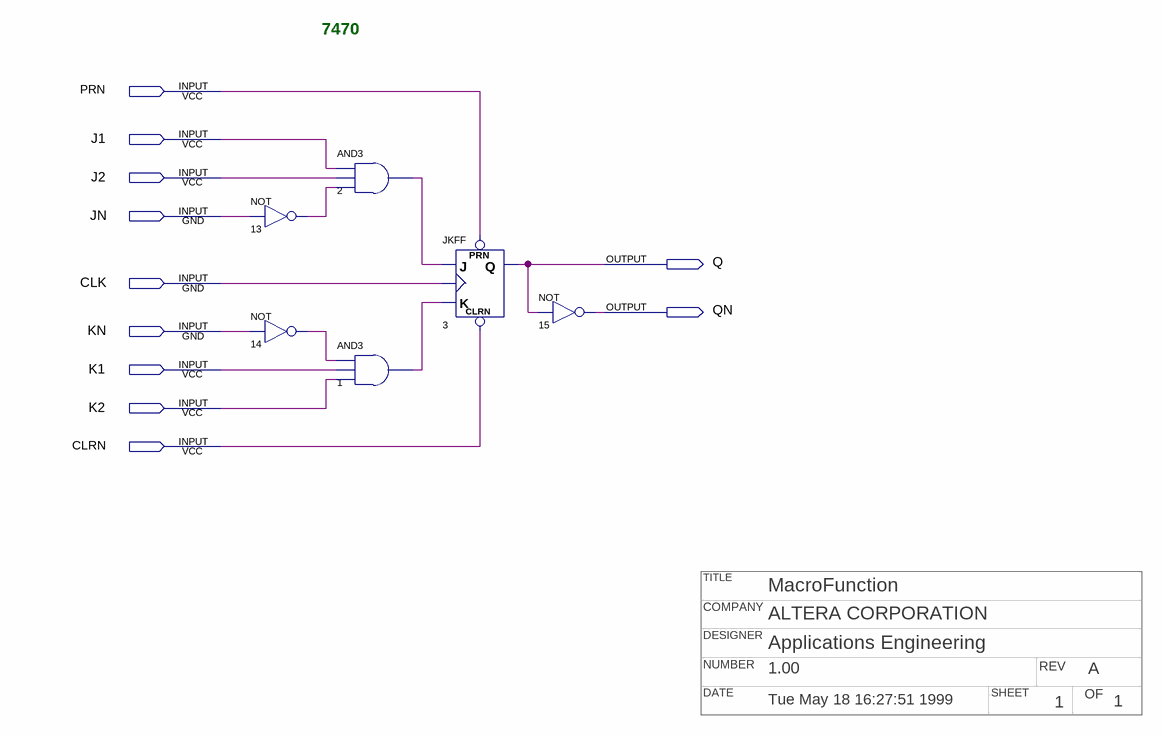
[diagram p0: schematic sheet]
// Quartus schematic 7470.bdf as structural Verilog: 6 symbols, 11 pins
// Title block: TITLE: MacroFunction; COMPANY: ALTERA CORPORATION; DESIGNER: Applications Engineering; NUMBER: 1.00; REV: A; DATE: Tue May 18 16:27:51 1999; SHEET: 1; OF: 1
module \7470  (
  input  PRN,
  input  J1,
  input  J2,
  input  JN,
  input  CLK,
  input  KN,
  input  K1,
  input  K2,
  input  CLRN,
  output Q,
  output QN
);

  wire n1_out, n2_out, n13_out, n14_out;

  not u_13 (n13_out, JN);
  not u_14 (n14_out, KN);
  and u_2 (n2_out, J1, J2, n13_out);
  and u_1 (n1_out, n14_out, K1, K2);
  JKFF u_3 (.PRN(PRN), .CLRN(CLRN), .K(n1_out), .J(n2_out), .CLK(CLK), .Q(Q));
  not u_15 (QN, Q);

  // Notes on the sheet:
  //   7470
endmodule
